# Altium schematic sheet ESP32-PoE_Rev_G1.SchDoc
size 594 x 419 mm
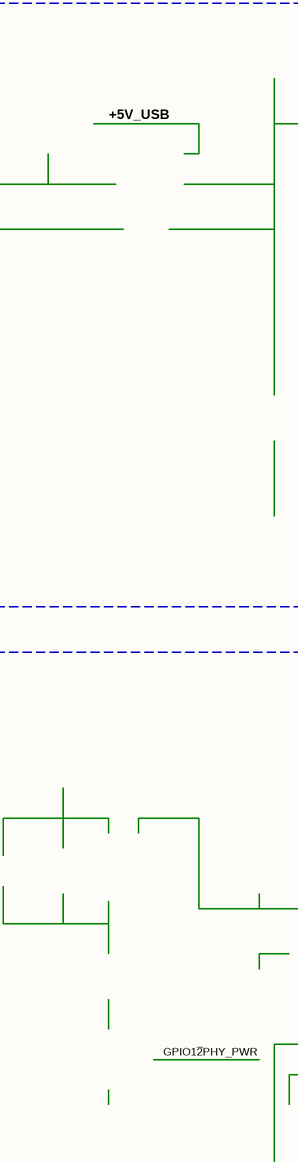
[diagram p0: ESP32-PoE_Rev_G1.SchDoc, top left]
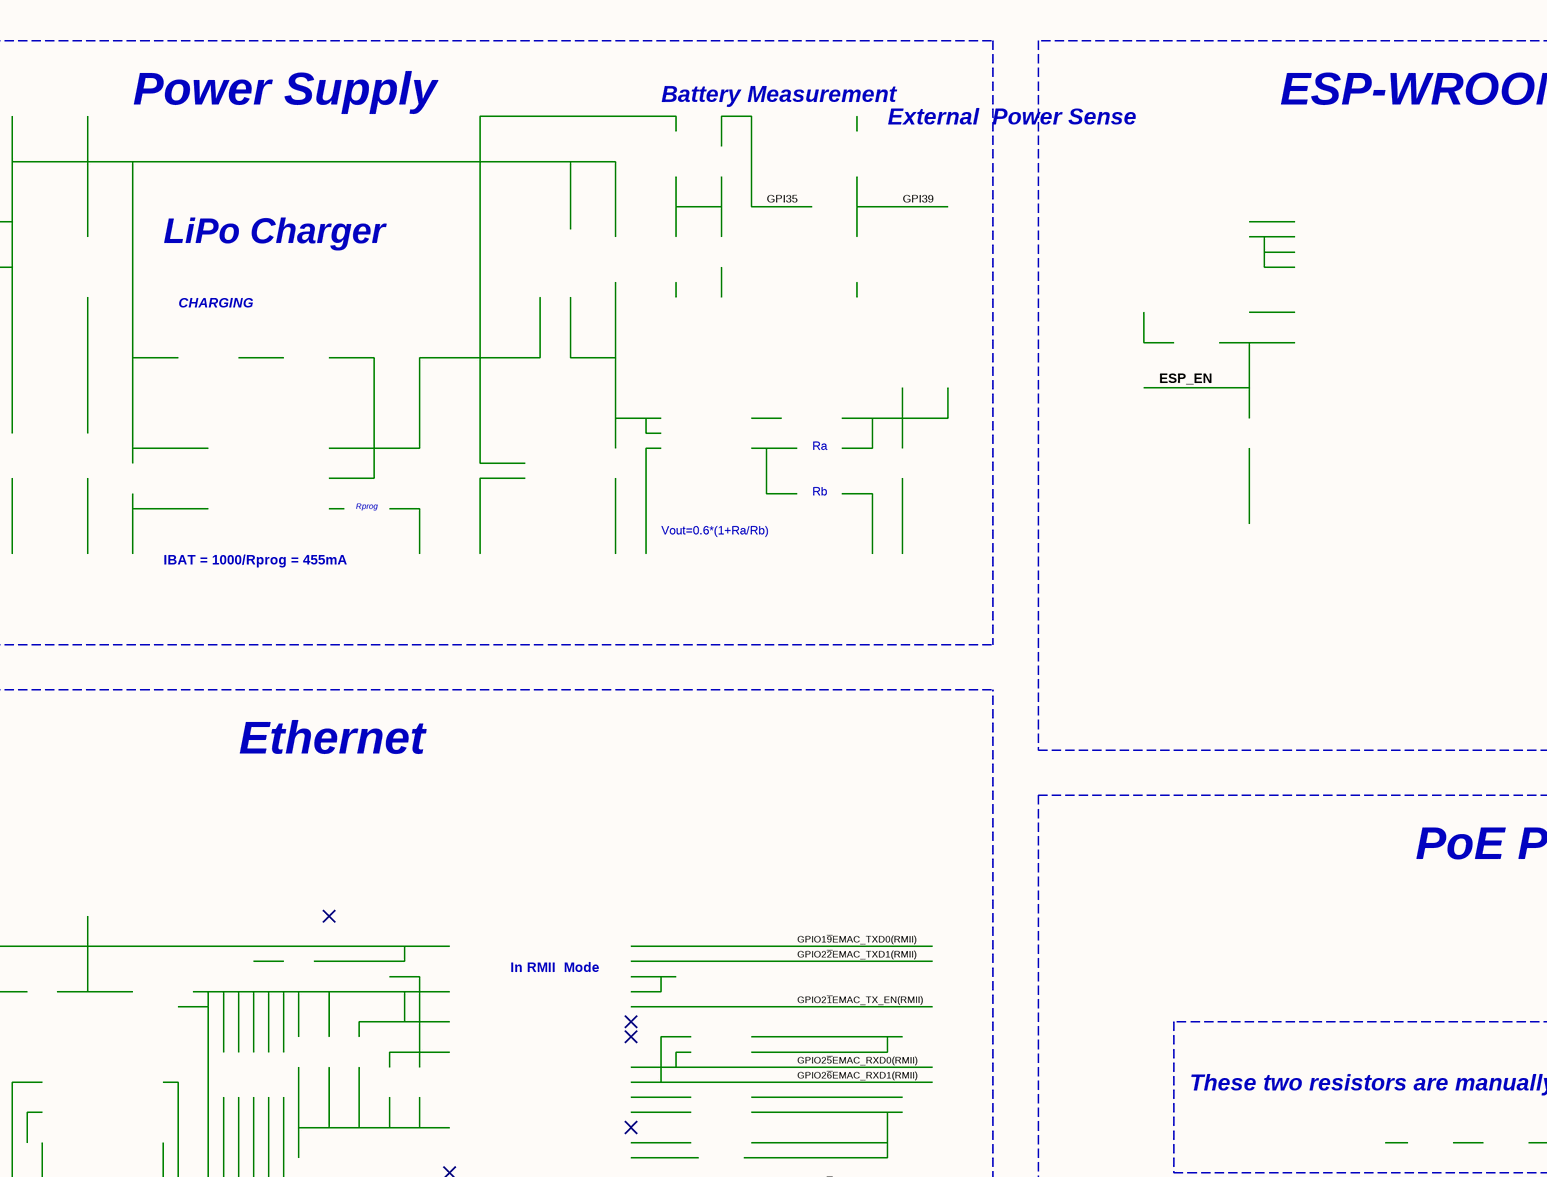
[diagram p1: ESP32-PoE_Rev_G1.SchDoc, top middle]
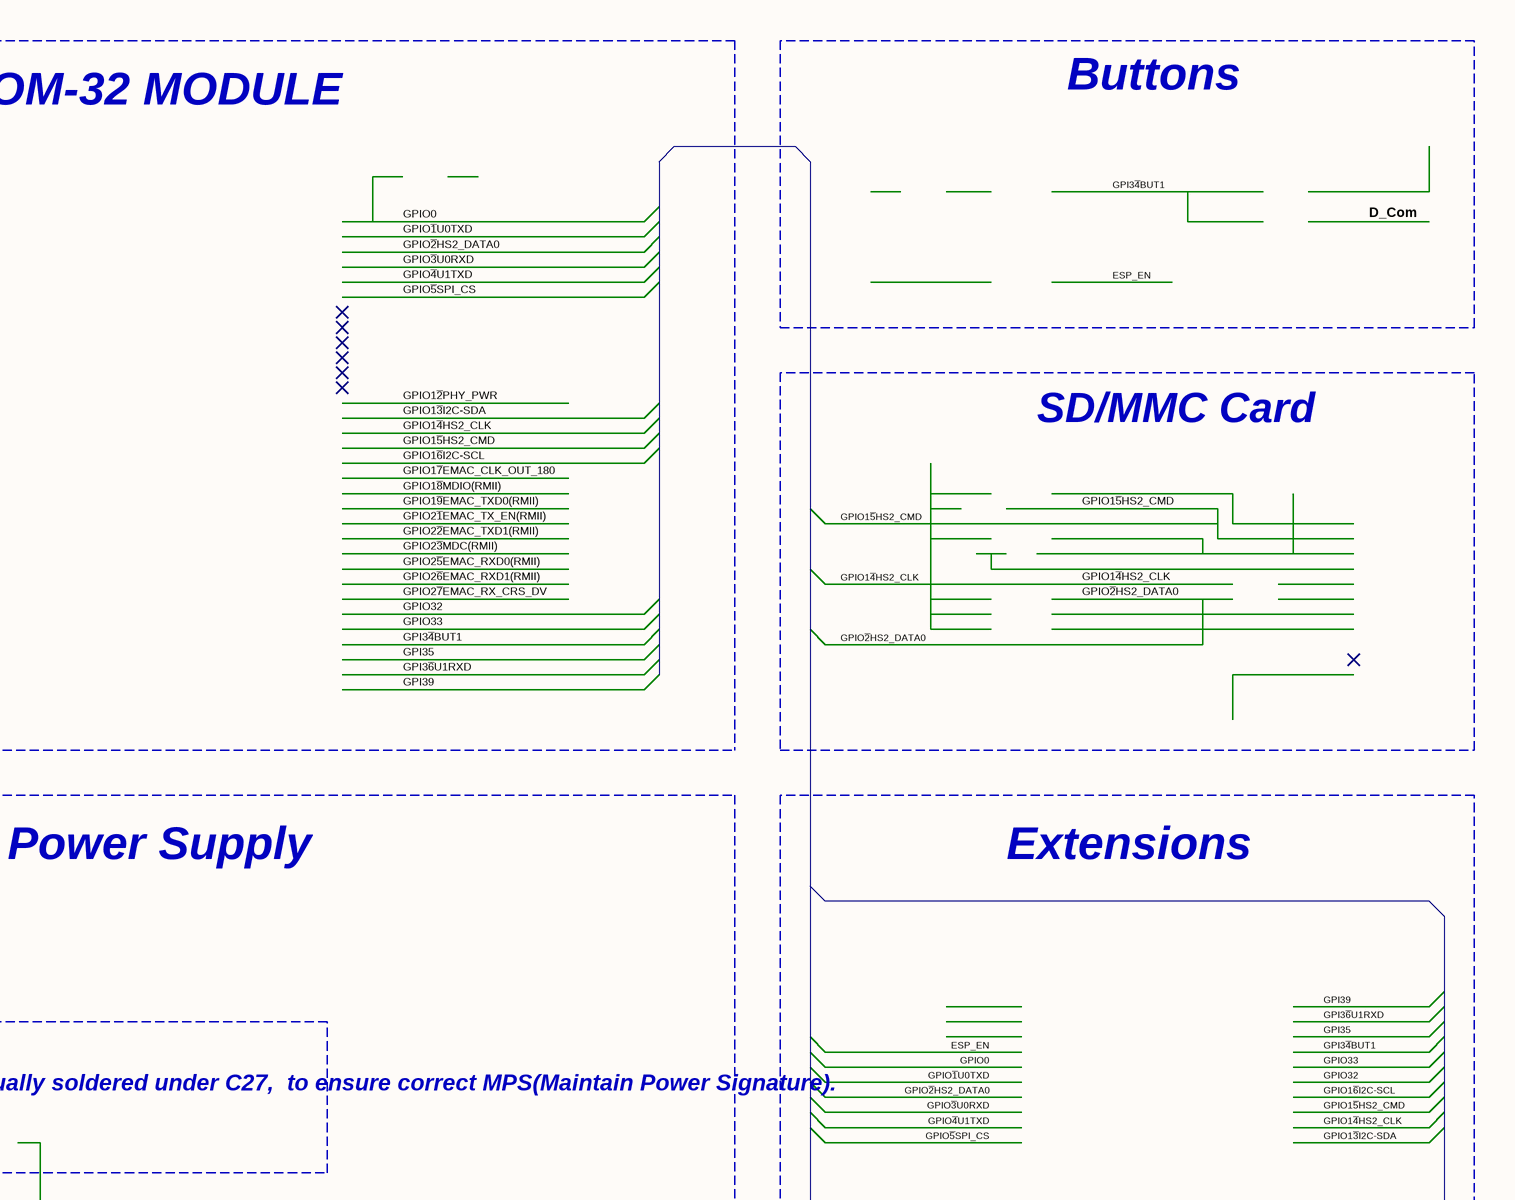
[diagram p2: ESP32-PoE_Rev_G1.SchDoc, top right]
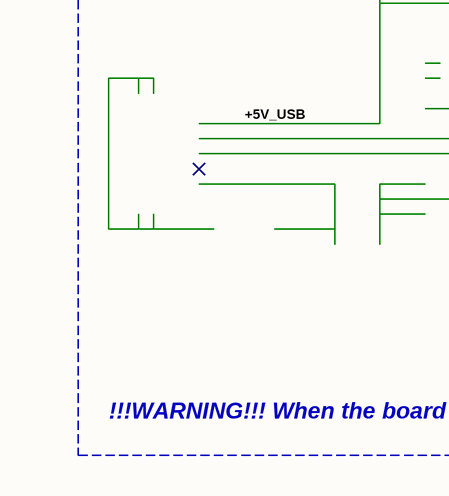
[diagram p3: ESP32-PoE_Rev_G1.SchDoc, bottom left]
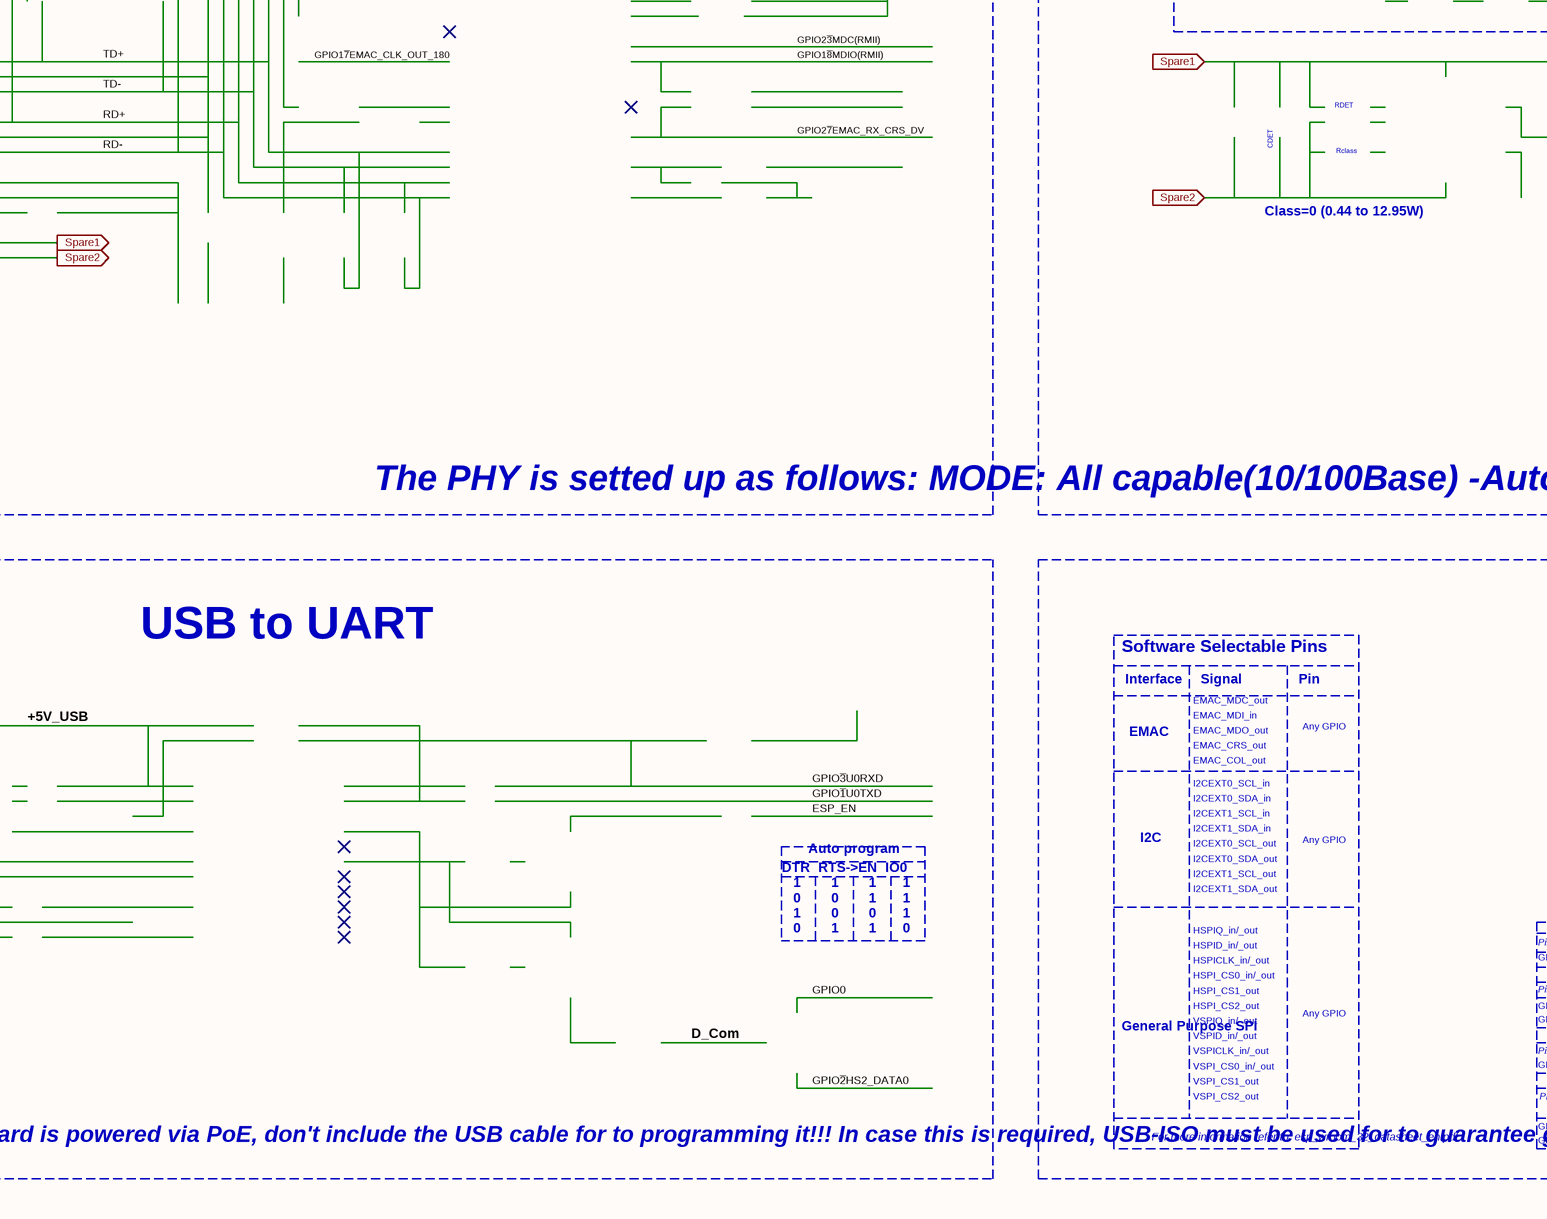
[diagram p4: ESP32-PoE_Rev_G1.SchDoc, bottom middle]
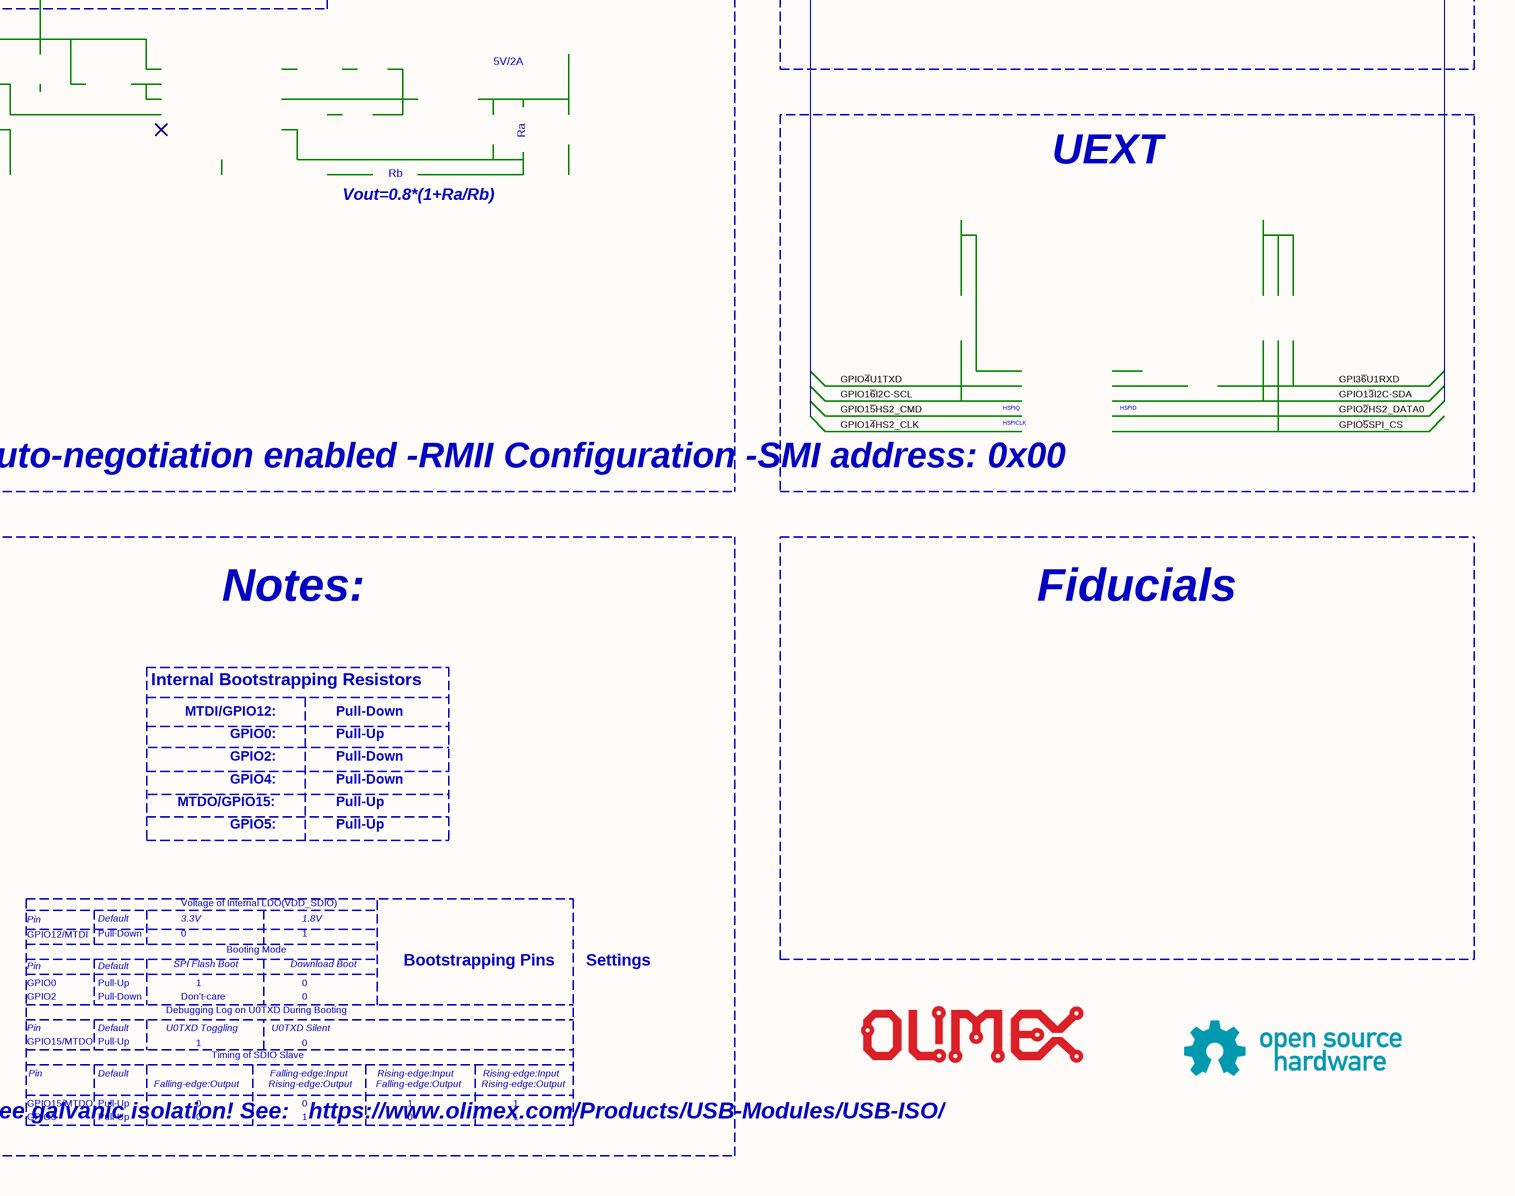
[diagram p5: ESP32-PoE_Rev_G1.SchDoc, bottom right]

## Ports
Spare1 (in), Spare1 (out), Spare2 (in), Spare2 (out)

## Notes on the sheet
- Power Supply
- Battery
  Measurement
- ESP-WROOM-32 MODULE
- Buttons
- External
  Power
  Sense
- LiPo Charger
- CHARGING
- Ra
- Rb
- SD/MMC Card
- IBAT = 1000/Rprog = 455mA
- Rprog
- Vout=0.6*(1+Ra/Rb)
- Ethernet
- PoE Power Supply
- Extensions
- In RMII
  Mode
- These two resistors are manually soldered under C27,
  to ensure correct MPS(Maintain Power Signature).
- RDET
- 5V/2A
- CDET
- Rclass
- Class=0 (0.44 to 12.95W)
- Vout=0.8*(1+Ra/Rb)
- UEXT
- HSPICLK
- HSPIQ
- HSPID
- The PHY is setted up as follows:
  MODE: All capable(10/100Base)
  -Auto-negotiation enabled
  -RMII Configuration
  -SMI address: 0x00
- Notes:
- Fiducials
- USB to UART
- Software Selectable Pins
- Interface
- EMAC_MDC_out
- Signal
- Pin
- Internal Bootstrapping Resistors
- EMAC
- EMAC_MDI_in
- EMAC_MDO_out
- EMAC_CRS_out
- EMAC_COL_out
- I2CEXT0_SCL_in
- Any GPIO
- MTDI/GPIO12:
- GPIO0:
- GPIO2:
- Pull-Down
- Pull-Up
- Auto program
- I2C
- I2CEXT0_SDA_in
- I2CEXT1_SCL_in
- I2CEXT1_SDA_in
- I2CEXT0_SCL_out
- I2CEXT0_SDA_out
- MTDO/GPIO15:
- GPIO4:
- GPIO5:
- DTR  RTS->EN  IO0
- 1
- 0
- I2CEXT1_SCL_out
- I2CEXT1_SDA_out
- HSPIQ_in/_out
- Voltage of Internal LDO(VDD_SDIO)
- HSPID_in/_out
- HSPICLK_in/_out
- HSPI_CS0_in/_out
- HSPI_CS1_out
- HSPI_CS2_out
- GPIO12/MTDI
- GPIO0
- Default
- SPI Flash Boot
- 3.3V
- Booting Mode
- Download Boot
- 1.8V
- Bootstrapping Pins
  Settings
- General
  Purpose
  SPI
- VSPIQ_in/_out
- VSPID_in/_out
- VSPI_CS0_in/_out
- VSPICLK_in/_out
- VSPI_CS1_out
- GPIO2
- GPIO15/MTDO
- Debugging Log on U0TXD During Booting
- U0TXD Toggling
- Don't-care
- Timing of SDIO Slave
- U0TXD Silent
- !!!WARNING!!!
  When the board is powered via PoE, don't include the USB cable for to programming it!!!
  In case this is required, USB-ISO must be used for to guarantee galvanic isolation!
  See:   https://www.olimex.com/Products/USB-Modules/USB-ISO/
- For more information refer to
  esp_wroom_32_datasheet_en.pdf.
- VSPI_CS2_out
- GPIO5
- Falling-edge:Output
- Rising-edge:Output
- Falling-edge:Input
- Rising-edge:Input
- 2
- 3
- 4
- 5
- 6
- 7
- 8
- 9
- 10
- 11
- A
- B
- C
- D
- E
- F
- G
- H
- https://www.olimex.com
- Title: ESP32-PoE
- File: ESP32-PoE_Rev_G1.sch
- Sheet: /
- OLIMEX LTD.
- KiCad E.D.A.  kicad (5.1.4)-1
- Size: A4
- Date: 2021-09-22
- Rev: G1
- Id: 1/1